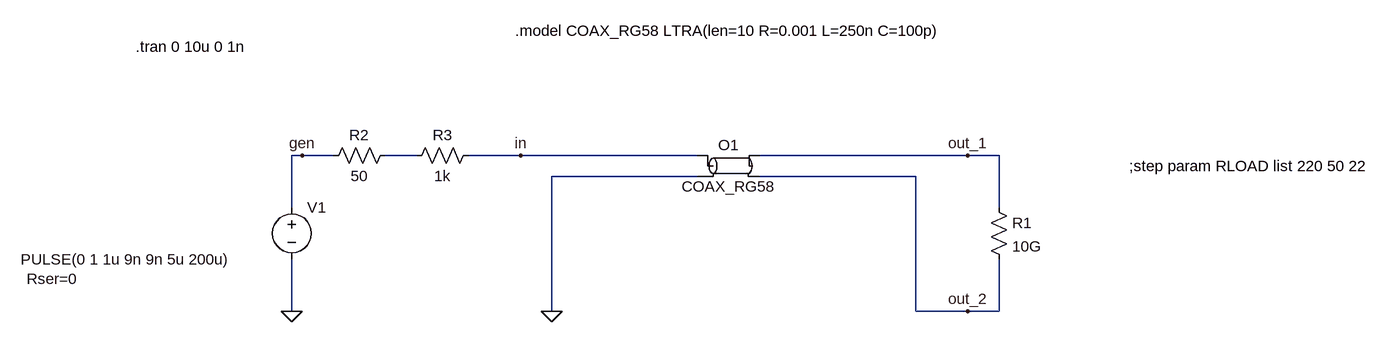
[diagram p0: schematic long_pulse_width_multiple_reflections.asc]
long_pulse_width_multiple_reflections.asc, the LTspice schematic file:
Version 4
SHEET 1 1332 680
WIRE -480 128 -496 128
WIRE -432 128 -480 128
WIRE -304 128 -352 128
WIRE -144 128 -224 128
WIRE 128 128 -144 128
WIRE 544 128 224 128
WIRE 592 128 544 128
WIRE 128 160 -96 160
WIRE 464 160 224 160
WIRE -496 208 -496 128
WIRE 592 208 592 128
WIRE -496 368 -496 288
WIRE -96 368 -96 160
WIRE 464 368 464 160
WIRE 544 368 464 368
WIRE 592 368 592 288
WIRE 592 368 544 368
FLAG -496 368 0
FLAG -96 368 0
FLAG 544 128 out_1
FLAG -144 128 in
FLAG 544 368 out_2
FLAG -480 128 gen
SYMBOL res 576 192 R0
SYMATTR InstName R1
SYMATTR Value 10G
SYMBOL voltage -496 192 R0
WINDOW 3 -417 96 Left 2
WINDOW 123 0 0 Left 0
WINDOW 39 -408 126 Left 2
SYMATTR Value PULSE(0 1 1u 9n 9n 5u 200u)
SYMATTR SpiceLine Rser=0
SYMATTR InstName V1
SYMBOL ltline 176 144 R0
SYMATTR InstName O1
SYMATTR Value COAX_RG58
SYMBOL res -336 112 R90
WINDOW 0 0 56 VBottom 2
WINDOW 3 32 56 VTop 2
SYMATTR InstName R2
SYMATTR Value 50
SYMBOL res -208 112 R90
WINDOW 0 0 56 VBottom 2
WINDOW 3 32 56 VTop 2
SYMATTR InstName R3
SYMATTR Value 1k
TEXT -152 -64 Left 2 !.model COAX_RG58 LTRA(len=10 R=0.001 L=250n C=100p)
TEXT -736 -40 Left 2 !.tran 0 10u 0 1n
TEXT 792 144 Left 2 !;step param RLOAD list 220 50 22

The netlist it stands for:
* long_pulse_width_multiple_reflections.asc
R1 out_1 out_2 10G
V1 gen 0 PULSE(0 1 1u 9n 9n 5u 200u) Rser=0
O1 in 0 out_1 out_2 COAX_RG58
R2 N001 gen 50
R3 in N001 1k
.model COAX_RG58 LTRA(len=10 R=0.001 L=250n C=100p)
.tran 0 10u 0 1n
;step param RLOAD list 220 50 22
.backanno
.end